# Altium schematic sheet Sheet1.SchDoc
size A
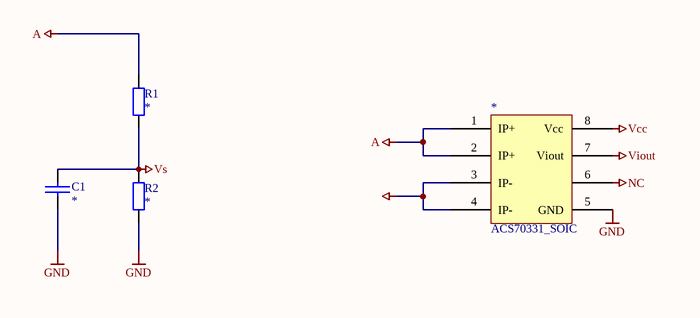
[diagram p0: Sheet1.SchDoc]

## Parts
*  ACS70331_SOIC  [ACS70331]
C1  *  [0805 CAP]
R1  *  [0805 RES]
R2  *  [0805 RES]

## Nets
A: *.1(IP+) *.2(IP+) R1.2
GND: *.5(GND) C1.2 R2.1
NC: *.6
Net*_3: *.3(IP-) *.4(IP-)
Vcc: *.8(Vcc)
Viout: *.7(Viout)
Vs: C1.1 R1.1 R2.2

## Library data of the parts
C1 = CerCap_SMT_0805: SMT ceramic capacitor 0805 size; Value: *
R1 R2 = Res_SMT_0805: 0805 resistor; Published: 8-Jun-2000; LatestRevisionDate: 17-Jul-2002; LatestRevisionNote: Re-released for DXP Platform.; PackageReference: AXIAL-0.4; Publisher: Altium Limited; Value: *; ComponentLink1Description: https://nz.mouser.com/datasheet/2/315/AOA0000C304-1149620.pdf